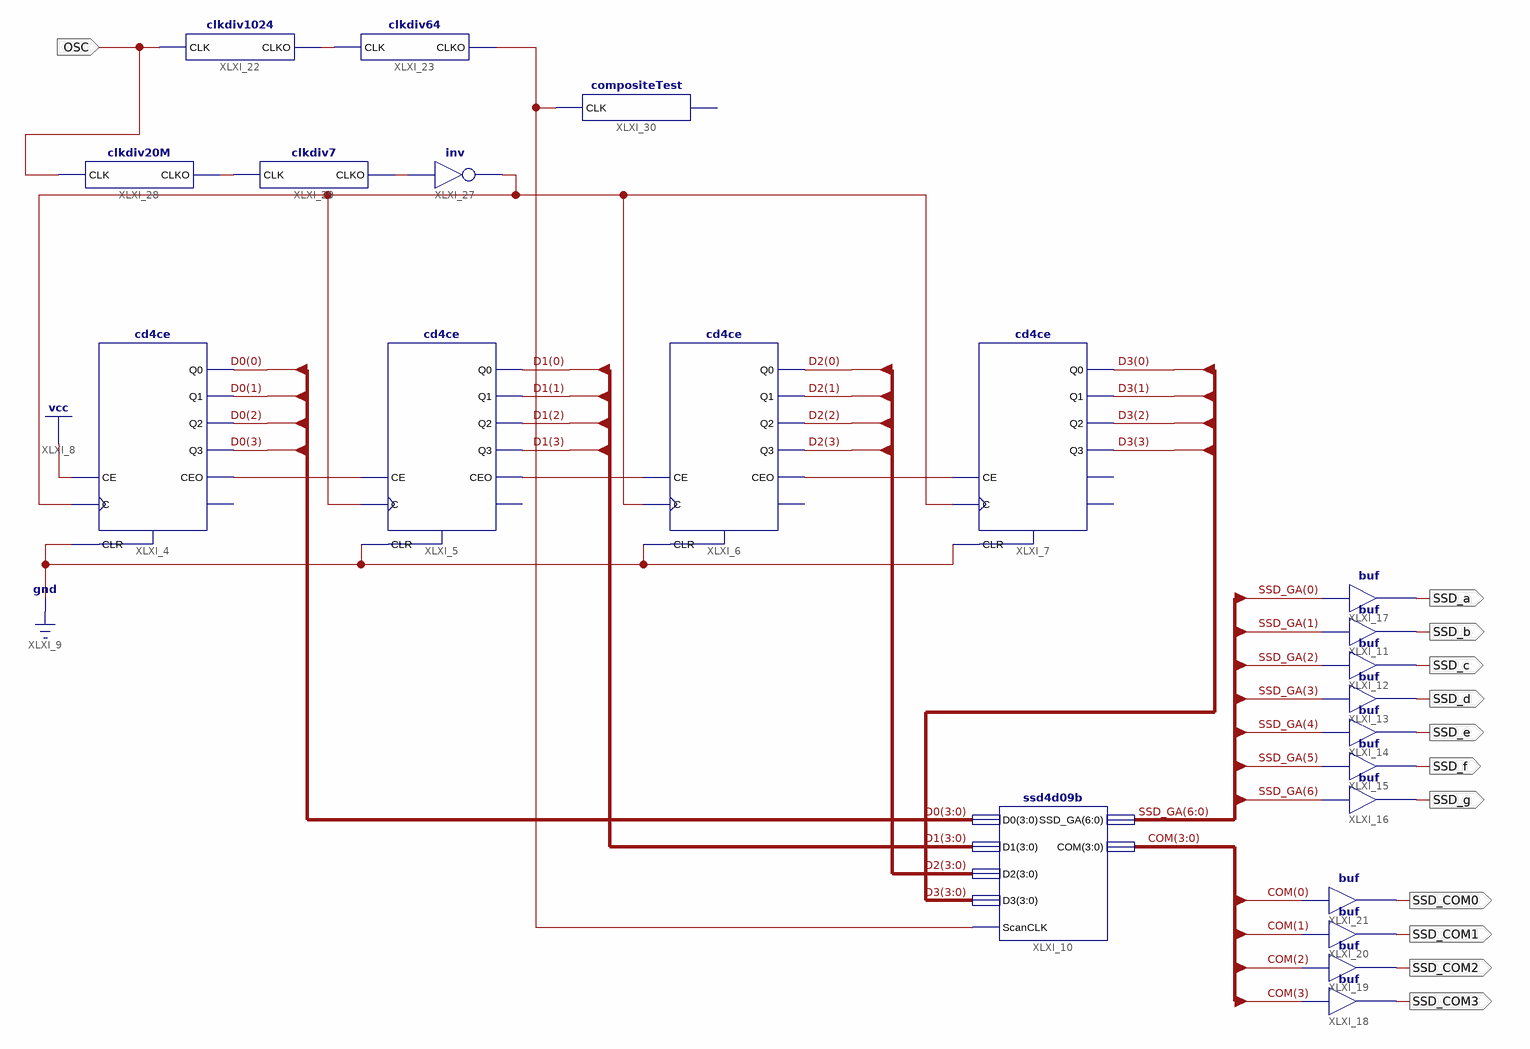
[diagram p0: schematic sheet 1]
// Xilinx ISE schematic main.sch (spartan6) as structural Verilog: 22 symbols, 12 ports
module main (
  input  OSC,
  output SSD_b,
  output SSD_c,
  output SSD_d,
  output SSD_e,
  output SSD_f,
  output SSD_g,
  output SSD_a,
  output SSD_COM3,
  output SSD_COM2,
  output SSD_COM1,
  output SSD_COM0
);

  wire XLXN_1, XLXN_2, XLXN_3, XLXN_15, XLXN_16, XLXN_23, XLXN_28, XLXN_29;
  wire [3:0] COM, D0, D1, D2, D3;
  wire [6:0] SSD_GA;

  cd4ce XLXI_4 (
    .C(XLXN_16), .CE(1'b1), .CLR(1'b0), .CEO(XLXN_1), .Q0(D0[0]), .Q1(D0[1]), .Q2(D0[2]), .Q3(D0[3]));  // open: TC
  cd4ce XLXI_5 (
    .C(XLXN_16), .CE(XLXN_1), .CLR(1'b0), .CEO(XLXN_2), .Q0(D1[0]), .Q1(D1[1]), .Q2(D1[2]), .Q3(D1[3]));  // open: TC
  cd4ce XLXI_6 (
    .C(XLXN_16), .CE(XLXN_2), .CLR(1'b0), .CEO(XLXN_3), .Q0(D2[0]), .Q1(D2[1]), .Q2(D2[2]), .Q3(D2[3]));  // open: TC
  cd4ce XLXI_7 (.C(XLXN_16), .CE(XLXN_3), .CLR(1'b0), .Q0(D3[0]), .Q1(D3[1]), .Q2(D3[2]), .Q3(D3[3]));  // open: CEO, TC
  ssd4d09b XLXI_10 (.COM(COM), .D0(D0), .D1(D1), .D2(D2), .D3(D3), .ScanCLK(XLXN_15), .SSD_GA(SSD_GA));
  buf XLXI_11 (SSD_b, SSD_GA[1]);
  buf XLXI_12 (SSD_c, SSD_GA[2]);
  buf XLXI_13 (SSD_d, SSD_GA[3]);
  buf XLXI_14 (SSD_e, SSD_GA[4]);
  buf XLXI_15 (SSD_f, SSD_GA[5]);
  buf XLXI_16 (SSD_g, SSD_GA[6]);
  buf XLXI_17 (SSD_a, SSD_GA[0]);
  buf XLXI_18 (SSD_COM3, COM[3]);
  buf XLXI_19 (SSD_COM2, COM[2]);
  buf XLXI_20 (SSD_COM1, COM[1]);
  buf XLXI_21 (SSD_COM0, COM[0]);
  clkdiv1024 XLXI_22 (.CLK(OSC), .CLKO(XLXN_23));
  clkdiv64 XLXI_23 (.CLK(XLXN_23), .CLKO(XLXN_15));
  not XLXI_27 (XLXN_16, XLXN_29);
  clkdiv20M XLXI_28 (.CLK(OSC), .CLKO(XLXN_28));
  clkdiv7 XLXI_29 (.CLK(XLXN_28), .CLKO(XLXN_29));
  compositeTest XLXI_30 (.CLK(XLXN_15));  // open: CLKO
endmodule
